# EAGLE design rpi-d25-v1 (EAGLE 9.6.2)
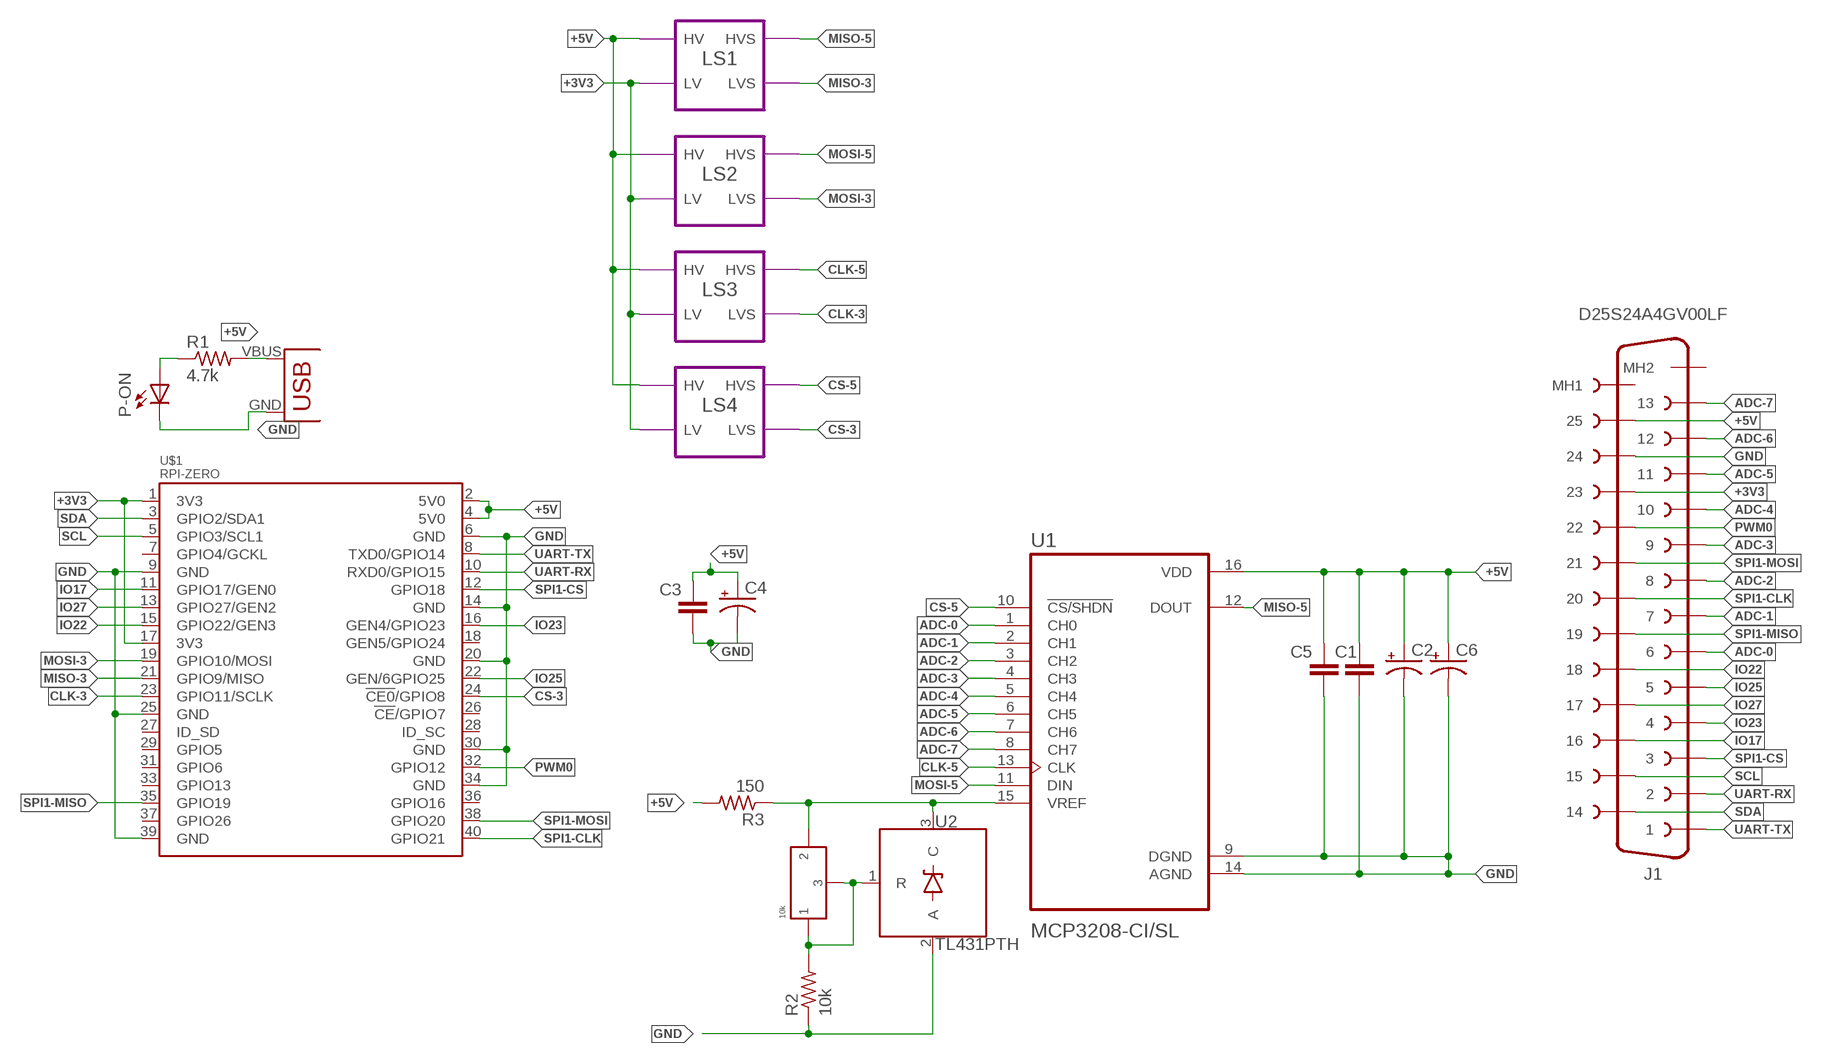
[diagram p0: schematic, sheet 1]

## Parts
C1  C-EUC0805  [C0805]
C2  CPOL-USB/3528-21R  [B/3528-21R]
C3  C-EUC0805  [C0805]
C4  CPOL-USB/3528-21R  [B/3528-21R]
C5  C-EUC0805  [C0805]
C6  CPOL-USB/3528-21R  [B/3528-21R]
J1  D25S24A4GV00LF  [D25S24A4GV00LF]
P-ON  LED3MM  [LED3MM]
PRESET1  10k  PRESET_LR  [PRESET_LR]
R1  4.7k  R-US_0204/7  [0204/7]
R2  10k  R-US_0204/7  [0204/7]
R3  150  R-US_0204/7  [0204/7]
U1  MCP3208-CI/SL  [SOIC127P600X175-16N]
U2  TL431PTH  [TO-92]
U$1  RPI-ZERO  [RASP_PI_ZERO_BOARD_FULL]
U$2  USB(POWER)  [USB(POWER)]

## Module instances
LS1 = LS
LS2 = LS
LS3 = LS
LS4 = LS

## Nets
+3V3: J1.23 U$1.1(3V3) U$1.17(3V3) ; port LS1.LV LS2.LV LS3.LV LS4.LV
+5V: C1.1 C2.+ C3.1 C4.+ C5.1 C6.+ J1.25 R1.2 R3.2 U1.16(VDD) U$1.2(5V0) U$1.4(5V0) U$2.VBUS(VCC) ; port LS1.HV LS2.HV LS3.HV LS4.HV
ADC-0: J1.6 U1.1(CH0)
ADC-1: J1.7 U1.2(CH1)
ADC-2: J1.8 U1.3(CH2)
ADC-3: J1.9 U1.4(CH3)
ADC-4: J1.10 U1.5(CH4)
ADC-5: J1.11 U1.6(CH5)
ADC-6: J1.12 U1.7(CH6)
ADC-7: J1.13 U1.8(CH7)
CLK-3: U$1.23(GPIO11/SCLK) ; port LS3.LVS
CLK-5: U1.13(CLK) ; port LS3.HVS
CS-3: U$1.24(!CE0!/GPIO8) ; port LS4.LVS
CS-5: U1.10(!CS/SHDN) ; port LS4.HVS
GND: C1.2 C2.- C3.2 C4.- C5.2 C6.- J1.24 P-ON.K(C) R2.1 U1.9(DGND) U1.14(AGND) U2.2(A) U$1.6(GND) U$1.9(GND) U$1.14(GND) U$1.20(GND) U$1.25(GND) U$1.30(GND) U$1.34(GND) U$1.39(GND) U$2.GND
IO17: J1.16 U$1.11(GPIO17/GEN0)
IO22: J1.18 U$1.15(GPIO22/GEN3)
IO23: J1.4 U$1.16(GEN4/GPIO23)
IO25: J1.5 U$1.22(GEN/6GPIO25)
IO27: J1.17 U$1.13(GPIO27/GEN2)
MISO-3: U$1.21(GPIO9/MISO) ; port LS1.LVS
MISO-5: U1.12(DOUT) ; port LS1.HVS
MOSI-3: U$1.19(GPIO10/MOSI) ; port LS2.LVS
MOSI-5: U1.11(DIN) ; port LS2.HVS
N$1: P-ON.A R1.1
N$2: PRESET1.P$1 PRESET1.P$3 R2.2 U2.1(R)
N$4: PRESET1.P$2 R3.1 U1.15(VREF) U2.3(C)
PWM0: J1.22 U$1.32(GPIO12)
SCL: J1.15 U$1.5(GPIO3/SCL1)
SDA: J1.14 U$1.3(GPIO2/SDA1)
SPI1-CLK: J1.20 U$1.40(GPIO21)
SPI1-CS: J1.3 U$1.12(GPIO18)
SPI1-MISO: J1.19 U$1.35(GPIO19)
SPI1-MOSI: J1.21 U$1.38(GPIO20)
UART-RX: J1.2 U$1.10(RXD0/GPIO15)
UART-TX: J1.1 U$1.8(TXD0/GPIO14)
Unconnected: J1.MH1 J1.MH2 U$1.7(GPIO4/GCKL) U$1.18(GEN5/GPIO24) U$1.26(!CE!/GPIO7) U$1.27(ID_SD) U$1.28(ID_SC) U$1.29(GPIO5) U$1.31(GPIO6) U$1.33(GPIO13) U$1.36(GPIO16) U$1.37(GPIO26)

## Library data of the parts
C1 C3 C5 = rcl:C-EU: CAPACITOR, European symbol; SPICEPREFIX: C
C2 C4 C6 = rcl:CPOL-US: POLARIZED CAPACITOR, American symbol; SPICEPREFIX: C
J1 = Connector_D-Sub:D25S24A4GV00LF: D-SUB, 25POS, RCPT, VERT SLDR Datasheet <https://cdn.amphenol-icc.com/media/wysiwyg/files/documentation/datasheet/inputoutput/io_dsub_d8656.pdf> Drawing <https://cdn.amphenol-icc.com/media/wysiwyg/files/drawing/c01-8646-0815.pdf>; CATEGORY: Connector; DESCRIPTION: 25 Position D-Sub Receptacle, Female Sockets Connector; GENDER: Female; MANUFACTURER: amphenol-icc; MPN: D25S24A4GV00LF; OPERATING_TEMP: -55°C to +125°C; PART_STATUS: Active; ROHS_COMPLIANT: EU RoHS With Exemption 6c; SERIES: DELTA D; SUB-CATEGORY: D-SUB; TYPE: Vertical
P-ON = CEDT_JANUARY_2015_v5:LED
PRESET1 = CEDT_JANUARY_2015_v5:PRESET_LR
R1-R3 = rcl:R-US_: RESISTOR, American symbol; SPICEPREFIX: R
U1 = MCP3208-CI_SL:MCP3208-CI/SL: Check availability <https://pricing.snapeda.com/parts/MCP3208-CI/SL/Microchip/view-part?ref=eda>; AVAILABILITY: In Stock; DESCRIPTION: 12 Bit Analog to Digital Converter 4, 8 Input 1 SAR 16-SOIC; MF: Microchip; MP: MCP3208-CI/SL; PACKAGE: SOIC-16 Microchip; PRICE: None; PURCHASE-URL: https://pricing.snapeda.com/search/part/MCP3208-CI/SL/?ref=eda
U2 = SparkFun-DiscreteSemi:TL431: TL431- Voltage Reference Precision Programmable Shunt Regulator Diode Datasheet <https://cdn.sparkfun.com/datasheets/Components/General%20IC/TL431-D.pdf> SparkFun Products: TL431-Voltage Reference PTH <https://www.sparkfun.com/products/11078> SparkFun Uh-Oh Battery Level Indicator <https://www.sparkfun.com/products/11087>; PROD_ID: IC-10947; SF_ID: COM-11078
U$1 = rpi-zero:RPI-ZERO
U$2 = CEDT_JANUARY_2015_v5:USB(POWER)

## Module LS
Ports: HV(pwr) LV(pwr) HVS(io) LVS(io)
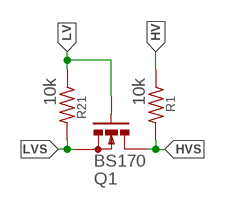
[diagram p1: schematic, module LS, sheet 1]

### Parts
Q1  BS170  [SOT54E]
R1  10k  R-US_0204/7  [0204/7]
R21  10k  R-US_0204/7  [0204/7]

### Nets
HV: R1.1
HVS: Q1.D R1.2
LV: Q1.G R21.1
LVS: Q1.S R21.2

### Library data of the parts
Q1 = transistor-small-signal:BS170: N-CHANNEL MOS FET
R1 R21 = rcl:R-US_: RESISTOR, American symbol; SPICEPREFIX: R

## Board
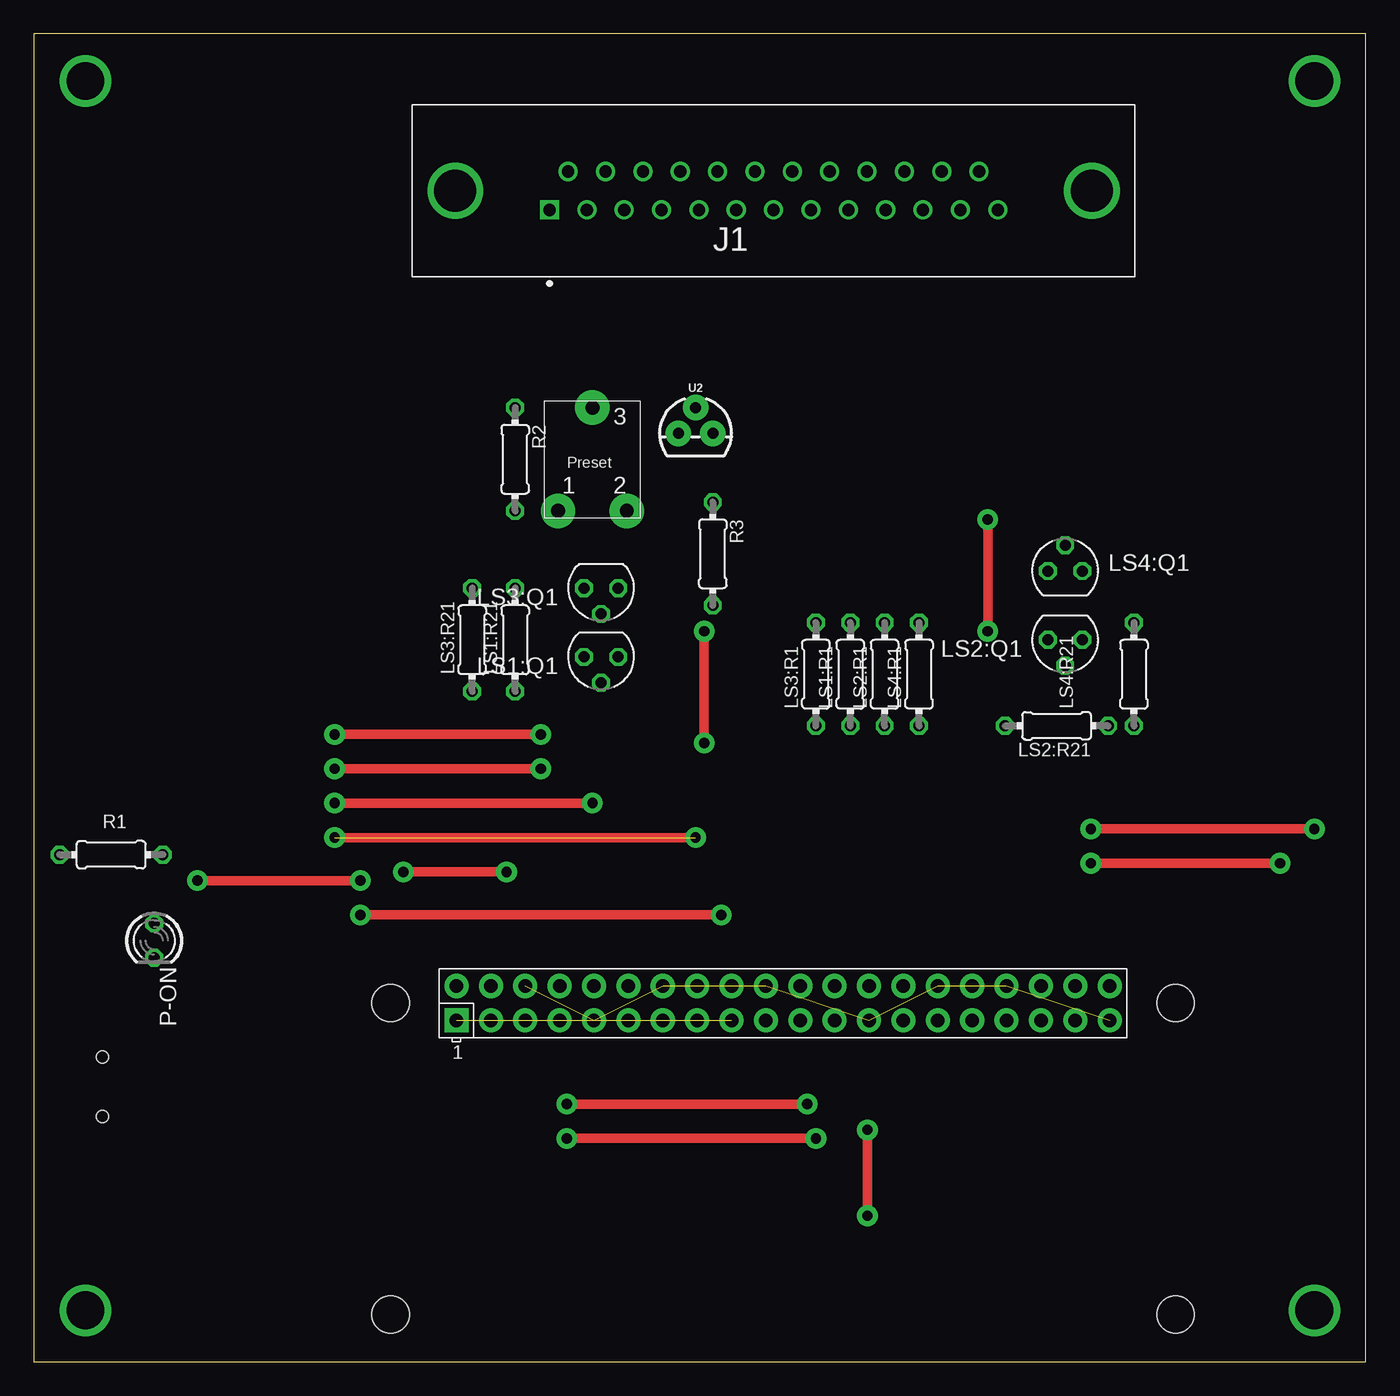
[diagram p2: board, top side]
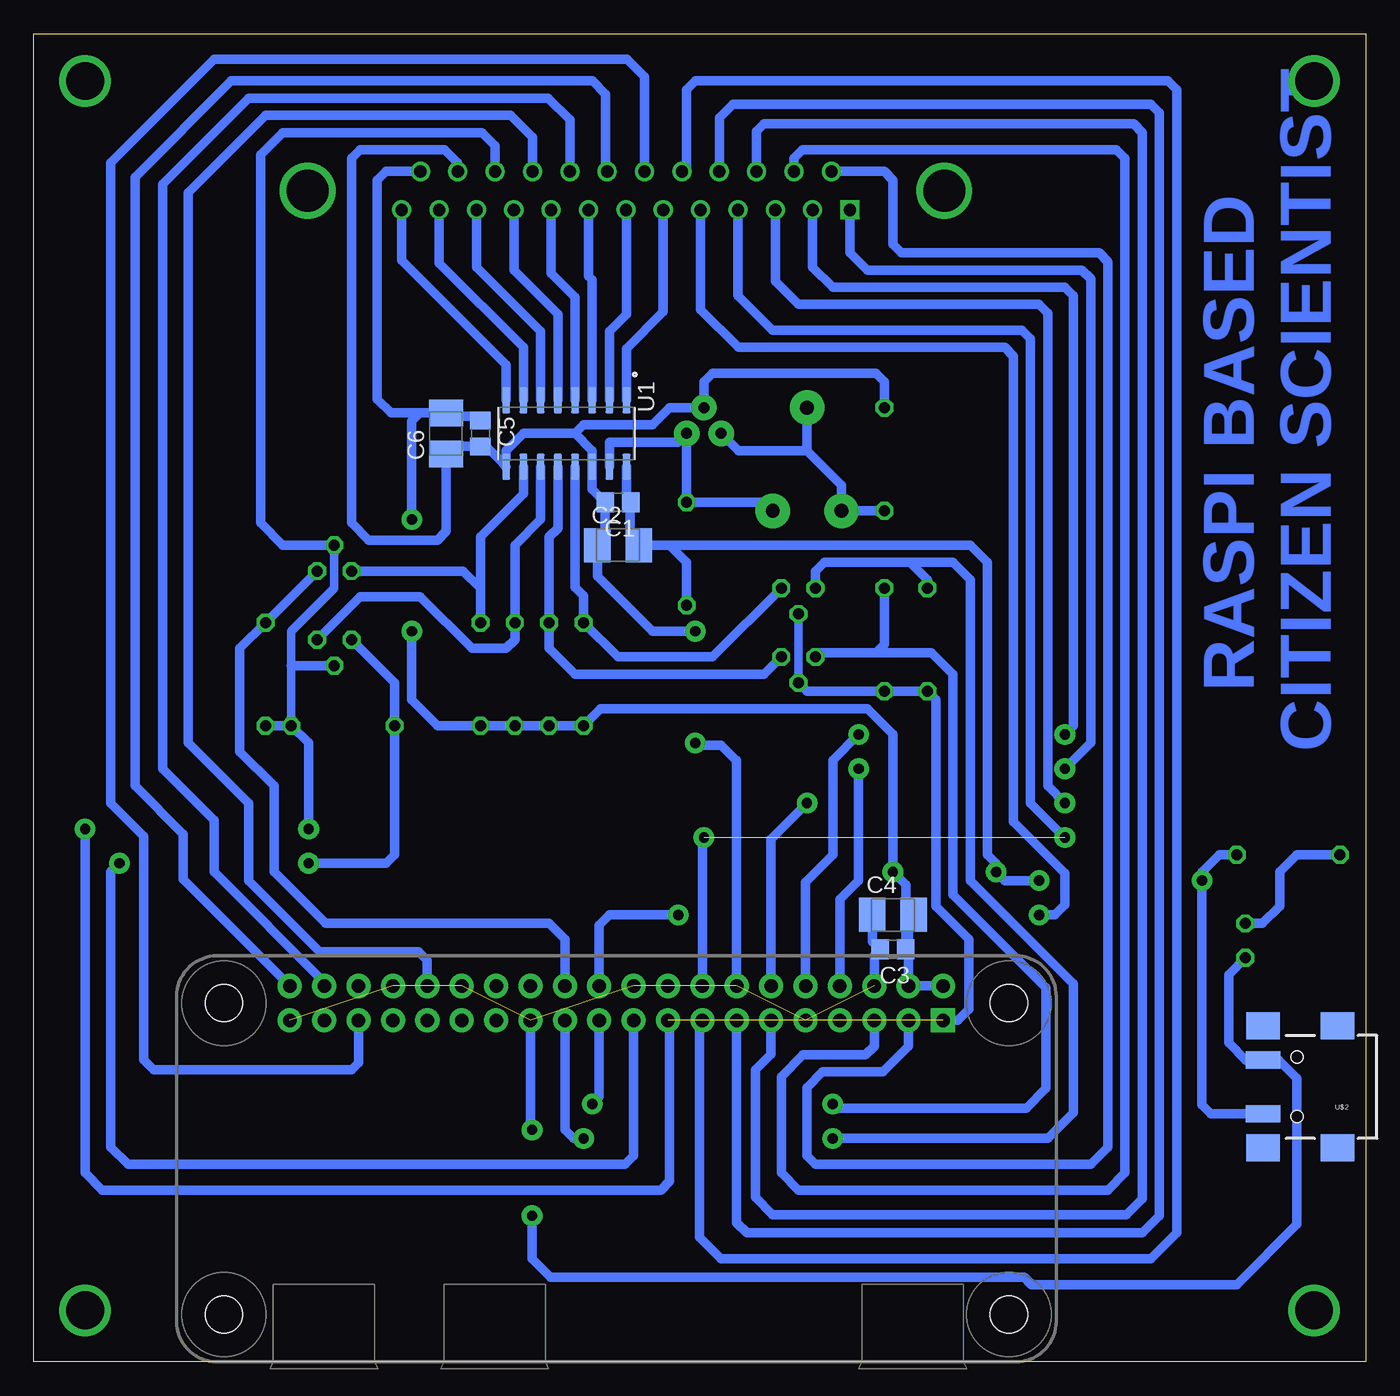
[diagram p3: board, bottom side, seen from below]

Size 98.41 x 98.09 mm. Coordinates in mm from the lower left corner, seen from the top.
Outline: 0,0 98.41,0 98.41,98.09 0,98.09 0,0
Copper layers (1*16): Top 0.035mm / dielectric 1.5mm / Bottom 0.035mm
Design rules "default": minimum track width 6mil, minimum drill 0.35mm, track to track 6mil, track to pad 6mil, pad to pad 6mil, via to via 6mil, smd to smd 6mil, copper to edge 40mil, drill to drill 6mil, minimum pad ring 10mil, minimum via ring 8mil, stop-mask expansion 4mil, vias tented up to drill 0mil, thermal gap 10mil

### Footprints (pad centres in the part's own frame; a part is rotated, then mirrored left to right if it is on the bottom)
C0805 = smd 1.3 x 1.5: 1 -0.95,0; 2 0.95,0
B/3528-21R = smd 1.95 x 2.5: + 1.525,0; - -1.525,0
D25S24A4GV00LF = drill 0.9 square: 1 0,0 | drill 0.9: 2 -2.76,0; 3 -5.52,0; 4 -8.28,0; 5 -11.04,0; 6 -13.8,0; 7 -16.56,0; 8 -19.32,0; 9 -22.08,0; 10 -24.84,0; 11 -27.6,0; 12 -30.36,0; 13 -33.12,0; 14 -1.38,-2.84; 15 -4.14,-2.84; 16 -6.9,-2.84; 17 -9.66,-2.84; 18 -12.42,-2.84; 19 -15.18,-2.84; 20 -17.94,-2.84; 21 -20.7,-2.84; 22 -23.46,-2.84; 23 -26.22,-2.84; 24 -28.98,-2.84; 25 -31.74,-2.84 | drill 3.1: MH1 -40.08,-1.42; MH2 6.96,-1.42
SOT54E = drill 0.813 octagon: D -1.27,0; G 0,1.905; S 1.27,0
0204/7 = drill 0.813 octagon: 1 -3.81,0; 2 3.81,0
LED3MM = drill 0.813 octagon: A -1.27,0; K 1.27,0
PRESET_LR = drill 1.016 pad 2.54: P$1 -2.54,-3.81; P$2 2.54,-3.81; P$3 0,3.81
SOIC127P600X175-16N = smd 1.9 x 0.6: 1 -2.455,4.445; 2 -2.455,3.175; 3 -2.455,1.905; 4 -2.455,0.635; 5 -2.455,-0.635; 6 -2.455,-1.905; 7 -2.455,-3.175; 8 -2.455,-4.445; 9 2.455,-4.445; 10 2.455,-3.175; 11 2.455,-1.905; 12 2.455,-0.635; 13 2.455,0.635; 14 2.455,1.905; 15 2.455,3.175; 16 2.455,4.445
TO-92 = drill 0.813 pad 1.88: 1 -1.27,0; 2 0,1.905; 3 1.27,0
RASP_PI_ZERO_BOARD_FULL = drill 1 pad 1.778 square: 1 8.37,25.23 | drill 1 pad 1.778: 2 8.37,27.77; 3 10.91,25.23; 4 10.91,27.77; 5 13.45,25.23; 6 13.45,27.77; 7 15.99,25.23; 8 15.99,27.77; 9 18.53,25.23; 10 18.53,27.77; 11 21.07,25.23; 12 21.07,27.77; 13 23.61,25.23; 14 23.61,27.77; 15 26.15,25.23; 16 26.15,27.77; 17 28.69,25.23; 18 28.69,27.77; 19 31.23,25.23; 20 31.23,27.77; 21 33.77,25.23; 22 33.77,27.77; 23 36.31,25.23; 24 36.31,27.77; 25 38.85,25.23; 26 38.85,27.77; 27 41.39,25.23; 28 41.39,27.77; 29 43.93,25.23; 30 43.93,27.77; 31 46.47,25.23; 32 46.47,27.77; 33 49.01,25.23; 34 49.01,27.77; 35 51.55,25.23; 36 51.55,27.77; 37 54.09,25.23; 38 54.09,27.77; 39 56.63,25.23; 40 56.63,27.77 | hole 2.75: 3.5,3.5; 3.5,26.5; 61.5,3.5; 61.5,26.5
USB(POWER) = smd 2.54 x 1.27: GND 2.5,-1.981; VBUS 2.5,1.981 | smd 2.5 x 2: GND@1 -3,-4.5; GND@2 -3,4.5; GND@3 2.5,4.5; GND@4 2.5,-4.5 | hole 0.9: 0,2.2; 0,-2.2

### Placement (x,y rotation side)
C1  55.24,63.5 180 bottom
C2  55.24,60.33 0 bottom
C3  34.92,30.48 180 bottom
C4  34.92,33.02 0 bottom
C5  65.41,68.58 270 bottom
C6  67.94,68.58 90 bottom
J1  38.1,85.09 180 top
LS1:Q1  BS170  [SOT54E]  41.91,52.07 180 top
LS1:R1  10k  [0204/7]  60.33,50.8 90 top
LS1:R21  10k  [0204/7]  35.56,53.34 90 top
LS2:Q1  BS170  [SOT54E]  76.2,53.34 180 top
LS2:R1  10k  [0204/7]  62.87,50.8 90 top
LS2:R21  10k  [0204/7]  75.56,46.99 180 top
LS3:Q1  BS170  [SOT54E]  41.91,57.15 180 top
LS3:R1  10k  [0204/7]  57.78,50.8 90 top
LS3:R21  10k  [0204/7]  32.38,53.34 90 top
LS4:Q1  BS170  [SOT54E]  76.2,58.42 0 top
LS4:R1  10k  [0204/7]  65.41,50.8 90 top
LS4:R21  10k  [0204/7]  81.28,50.8 90 top
P-ON  8.89,31.11 270 top
PRESET1  41.27,66.67 0 top
R1  5.71,37.47 0 top
R2  35.56,66.67 270 top
R3  50.16,59.69 270 top
U1  59.05,68.58 270 bottom
U2  48.9,68.58 0 top
U$1  22.86,0 0 top
U$2  5.08,20.32 180 bottom

### Tracks (layer width: path | path; a pad name or v marks a point on that pad's centre or on a via)
+3V3  (via drill 0.76 pad 1.52)  (1 unrouted)
  Top 0.711: v78.11,39.37 v94.61,39.37
  Bottom 0.61: LS3:Q1.G LS1:Q1.G | LS4:Q1.G 76.2,57.15 79.38,53.98 79.38,51.44 LS2:R21.1
  Bottom 0.711: LS1:Q1.G 41.27,49.53 LS1:R21.1 LS3:R21.1 31.75,48.9 31.75,33.66 29.32,31.23 29.32,26.04 30.13,25.23 U$1.1 | 79.38,51.44 LS2:Q1.G | J1.23 64.32,89.83 65.29,90.81 80.01,90.81 81.66,89.15 81.66,61.98 80.01,60.33 LS4:Q1.G | U$1.17 51.44,25.11 51.44,13.34 52.07,12.7 93.34,12.7 94.61,13.97 v94.61,39.37 | v78.11,39.37 78.11,45.72 LS2:R21.1 LS4:R21.1
+5V  (via drill 0.76 pad 1.52)
  Top 0.711: v34.92,36.2 v27.3,36.2 | v70.48,62.23 v70.48,53.98 | v24.13,35.56 v12.09,35.56
  Bottom 0.711: 51.44,60.33 50.16,59.05 R3.2 | U1.16 54.61,63.81 C1.1 54.35,63.44 54.35,60.96 C2.+ 51.44,60.33 | C5.1 65.72,69.85 67.94,69.85 C6.+ 69.85,70.11 | U$2.VBUS 11.43,18.34 12.09,19 v12.09,35.56 12.09,36.17 10.79,37.47 R1.2 | 69.85,70.11 72.01,70.11 73.03,71.12 73.03,87.3 72.39,87.93 J1.25 | 25.4,35.56 v24.13,35.56 26.67,35.56 v27.3,36.2 27.3,36.83 27.94,37.47 27.94,59.05 29.21,60.33 51.44,60.33 | v70.48,53.98 70.48,48.9 68.58,46.99 LS4:R1.1 LS2:R1.1 LS1:R1.1 LS3:R1.1 56.52,48.26 36.83,48.26 34.92,46.35 v34.92,36.2 33.98,35.24 C3.1 33.77,30.27 | v70.48,62.23 70.48,69.47 69.85,70.11 | 31.23,27.71 U$1.2 U$1.4 33.77,30.27 | C4.+ 33.77,32.65 33.77,30.27
ADC-0
  Bottom 0.711: U1.1 54.61,74.84 51.9,77.56 J1.6
ADC-1
  Bottom 0.711: U1.2 55.88,76.11 54.61,77.39 54.61,85.04 J1.7
ADC-2
  Bottom 0.711: J1.8 57.42,80.19 57.15,79.92 U1.3
ADC-3
  Bottom 0.711: J1.9 60.18,80.42 58.42,78.66 U1.4
ADC-4
  Bottom 0.711: U1.5 59.69,77.39 62.94,80.64 J1.10
ADC-5
  Bottom 0.711: J1.11 65.7,80.86 60.96,76.11 U1.6
ADC-6
  Bottom 0.711: U1.7 62.23,74.93 68.46,81.16 J1.12
ADC-7
  Bottom 0.711: J1.13 71.22,81.38 63.5,73.66 U1.8
CLK-3  (via drill 0.76 pad 1.52)
  Top 0.711: v39.37,16.51 v57.78,16.51
  Bottom 0.711: LS3:Q1.S 40.64,58.42 40.01,59.05 33.66,59.05 | U$1.23 59.17,17.14 58.53,16.51 v57.78,16.51 | v39.37,16.51 23.5,16.51 21.59,18.41 21.59,27.94 29.21,35.56 29.21,57.78 30.48,59.05 33.66,59.05 | LS3:R21.2 32.38,57.78 33.66,59.05
CLK-5
  Bottom 0.711: U1.13 58.42,57.23 57.78,56.6 LS3:R1.2 55.24,52.07 48.26,52.07 LS3:Q1.D
CS-3
  Bottom 0.711: LS4:Q1.S LS4:R21.2 83.19,52.7 83.19,45.09 80.64,42.55 80.64,36.2 76.83,32.38 60.33,32.38 59.17,31.23 U$1.24
CS-5
  Bottom 0.711: U1.10 62.23,64.14 65.41,60.96 LS4:R1.2 65.41,57.15 66.67,58.42 LS4:Q1.D
GND  (via drill 0.76 pad 1.52)  (7 unrouted)
  Top 0.711: v49.53,53.98 v49.53,45.72 | v61.59,17.14 v61.59,10.79
  Bottom 0.711: R2.1 35.56,72.39 36.2,73.03 48.26,73.03 48.9,72.39 U2.2 51.44,70.48 52.7,69.22 57.78,69.22 58.42,68.58 | U1.9 63.77,66.4 | 63.77,66.4 65,67.63 C5.2 67.37,67.63 C6.- 67.94,61.34 68.58,60.7 73.66,60.7 74.93,61.98 74.93,88.9 74.3,89.53 68.05,89.53 67.08,88.56 J1.24 | P-ON.K 10.12,28.61 10.12,23.57 8.85,22.3 U$2.GND 6.43,22.3 5.08,20.95 5.08,10.16 9.53,5.71 24.69,5.71 25.22,6.25 60.22,6.25 61.59,7.62 v61.59,10.79 | 58.42,68.58 57.15,67.31 U1.14 57.15,64.45 C1.2 56.2,60.9 C2.- 56.77,58.04 52.7,53.98 v49.53,53.98 | 58.42,68.58 62.23,68.58 63.5,67.31 63.5,66.67 63.77,66.4 | U$1.14 46.47,44.45 46.52,44.45 47.62,45.55 49.65,45.55 49.65,45.6 v49.53,45.72 | U$1.25 61.71,17.26 v61.59,17.14 | U$1.6 36.31,30.05 C3.2 36.45,31.05 C4.-
IO17
  Bottom 0.711: J1.16 45,90.89 44.45,91.44 17.14,91.44 16.51,90.81 16.51,12.06 17.68,10.89 43.81,10.89 45.09,12.16 45.09,21.59 43.93,22.75 U$1.11
IO22
  Bottom 0.711: J1.18 50.16,88.28 50.16,93.98 49.53,94.61 14.61,94.61 13.97,93.98 13.97,9.53 15.88,7.62 47.62,7.62 49.21,9.21 49.21,25.03 U$1.15
IO23  (via drill 0.76 pad 1.52)  (1 unrouted)
  Top 0.711: v48.9,38.73 v22.23,38.73
  Bottom 0.711: J1.4 46.38,78.77 43.81,76.2 25.4,76.2 24.77,75.56 24.77,41.27 v22.23,38.73 | v48.9,38.73 49.01,38.62 U$1.16
IO25  (via drill 0.76 pad 1.52)
  Top 0.711: v24.13,33.02 v50.8,33.02
  Bottom 0.711: J1.5 49.14,77.72 46.35,74.93 26.67,74.93 26.04,74.3 26.04,39.9 22.23,36.09 22.23,33.76 22.97,33.02 v24.13,33.02 | v50.8,33.02 55.88,33.02 56.63,32.27 U$1.22
IO27
  Bottom 0.711: J1.17 47.76,91.89 46.74,92.91 15.88,92.91 15.24,92.28 15.24,10.79 16.51,9.53 45.72,9.53 46.47,10.28 U$1.13
MISO-3  (via drill 0.76 pad 1.52)
  Top 0.711: v39.37,19.05 v57.15,19.05
  Bottom 0.711: LS1:Q1.S 40.32,52.39 36.2,52.39 | U$1.21 56.63,19.57 v57.15,19.05 | v39.37,19.05 39.05,18.73 25.08,18.73 23.61,20.2 23.61,27.64 30.48,34.5 30.48,50.8 32.07,52.39 36.2,52.39 | 36.2,52.39 35.56,53.02 LS1:R21.2
MISO-5
  Bottom 0.711: U1.12 59.69,61.59 60.33,60.96 LS1:R1.2 60.33,52.7 58.42,50.8 44.45,50.8 LS1:Q1.D
MOSI-3  (via drill 0.76 pad 1.52)
  Top 0.711: v92.08,36.83 v78.11,36.83
  Bottom 0.711: LS2:Q1.S 71.75,50.16 LS2:R21.2 71.75,37.47 72.39,36.83 v78.11,36.83 | v92.08,36.83 92.71,36.2 92.71,15.88 91.44,14.61 54.73,14.61 54.09,15.24 U$1.19
MOSI-5
  Bottom 0.711: U1.11 60.96,62.23 62.87,60.33 LS2:R1.2 62.87,53.34 63.5,52.7 66.04,52.7 69.85,56.52 74.3,56.52 LS2:Q1.D
N$1
  Bottom 0.711: R1.1 5.08,37.47 6.35,36.2 6.35,33.66 7.62,32.38 P-ON.A
N$2
  Bottom 0.711: R2.2 PRESET1.P$1 38.73,64.77 41.27,67.31 | U2.1 46.35,67.31 41.27,67.31 | PRESET1.P$3 41.27,67.31
N$3  (via drill 2.79 pad 3.81)
  other vias: 3.81,94.61
N$4
  Bottom 0.711: U1.15 55.88,67.94 50.8,67.94 U2.3 R3.1 44.45,63.5 PRESET1.P$2
N$5  (via drill 2.79 pad 3.81)
  other vias: 94.61,94.61
N$6  (via drill 2.79 pad 3.81)
  other vias: 94.61,3.81
N$7  (via drill 2.79 pad 3.81)
  other vias: 3.81,3.81
PWM0
  Bottom 0.711: U$1.32 69.33,29.68 69.97,30.31 77.3,30.31 82.55,35.56 82.55,41.27 87,45.72 87,86.36 81.28,92.08 63.16,92.08 61.56,90.47 J1.22
SCL
  Bottom 0.711: U$1.5 36.31,23.32 36.95,22.69 41.56,22.69 43.18,21.07 43.18,13.97 41.91,12.7 19.05,12.7 17.78,13.97 17.78,88.9 18.41,89.53 41.6,89.53 42.24,88.9 J1.15
SDA
  Bottom 0.711: J1.14 35.56,87.93 34.92,87.3 34.92,82.55 34.29,81.92 19.68,81.92 19.05,81.28 19.05,15.88 20.32,14.61 40.64,14.61 41.27,15.24 41.27,20.27 40.12,21.42 35.67,21.42 33.77,23.32 U$1.3
SPI1-CLK
  Bottom 0.711: J1.20 56.16,88.05 56.16,93.64 57.12,94.61 83.82,94.61 90.92,87.52 90.92,42.55 87.37,38.99 87.37,35.65 U$1.40
SPI1-CS  (via drill 0.76 pad 1.52)
  Top 0.711: v22.23,41.27 v41.27,41.27
  Bottom 0.711: J1.3 43.62,79.81 41.91,78.11 24.13,78.11 23.5,77.47 23.5,42.55 v22.23,41.27 | v41.27,41.27 43.93,38.62 U$1.12
SPI1-MISO
  Bottom 0.711: J1.19 53.28,94.92 54.57,96.2 85.09,96.2 92.71,88.58 92.71,41.27 90.28,38.85 90.28,22.34 89.53,21.59 74.93,21.59 74.41,22.11 U$1.35
SPI1-MOSI
  Bottom 0.711: J1.21 58.8,91.74 60.41,93.34 82.55,93.34 88.9,87 88.9,43.81 85.09,40.01 85.09,36.2 76.95,28.05 U$1.38
UART-RX  (via drill 0.76 pad 1.52)
  Top 0.711: v22.23,46.35 v37.47,46.35
  Bottom 0.711: J1.2 40.86,80.86 39.37,79.38 22.23,79.38 21.59,78.74 21.59,46.99 v22.23,46.35 | U$1.10 41.39,35.45 39.37,37.47 39.37,44.45 v37.47,46.35
UART-TX  (via drill 0.76 pad 1.52)
  Top 0.711: v37.47,43.81 v22.23,43.81
  Bottom 0.711: J1.1 38.1,81.92 36.83,80.64 20.95,80.64 20.32,80.01 20.32,45.72 v22.23,43.81 | U$1.8 38.85,34.17 37.47,35.56 v37.47,43.81

### Text on the board
Bottom: RASPI BASED / CITIZEN SCIENTIST